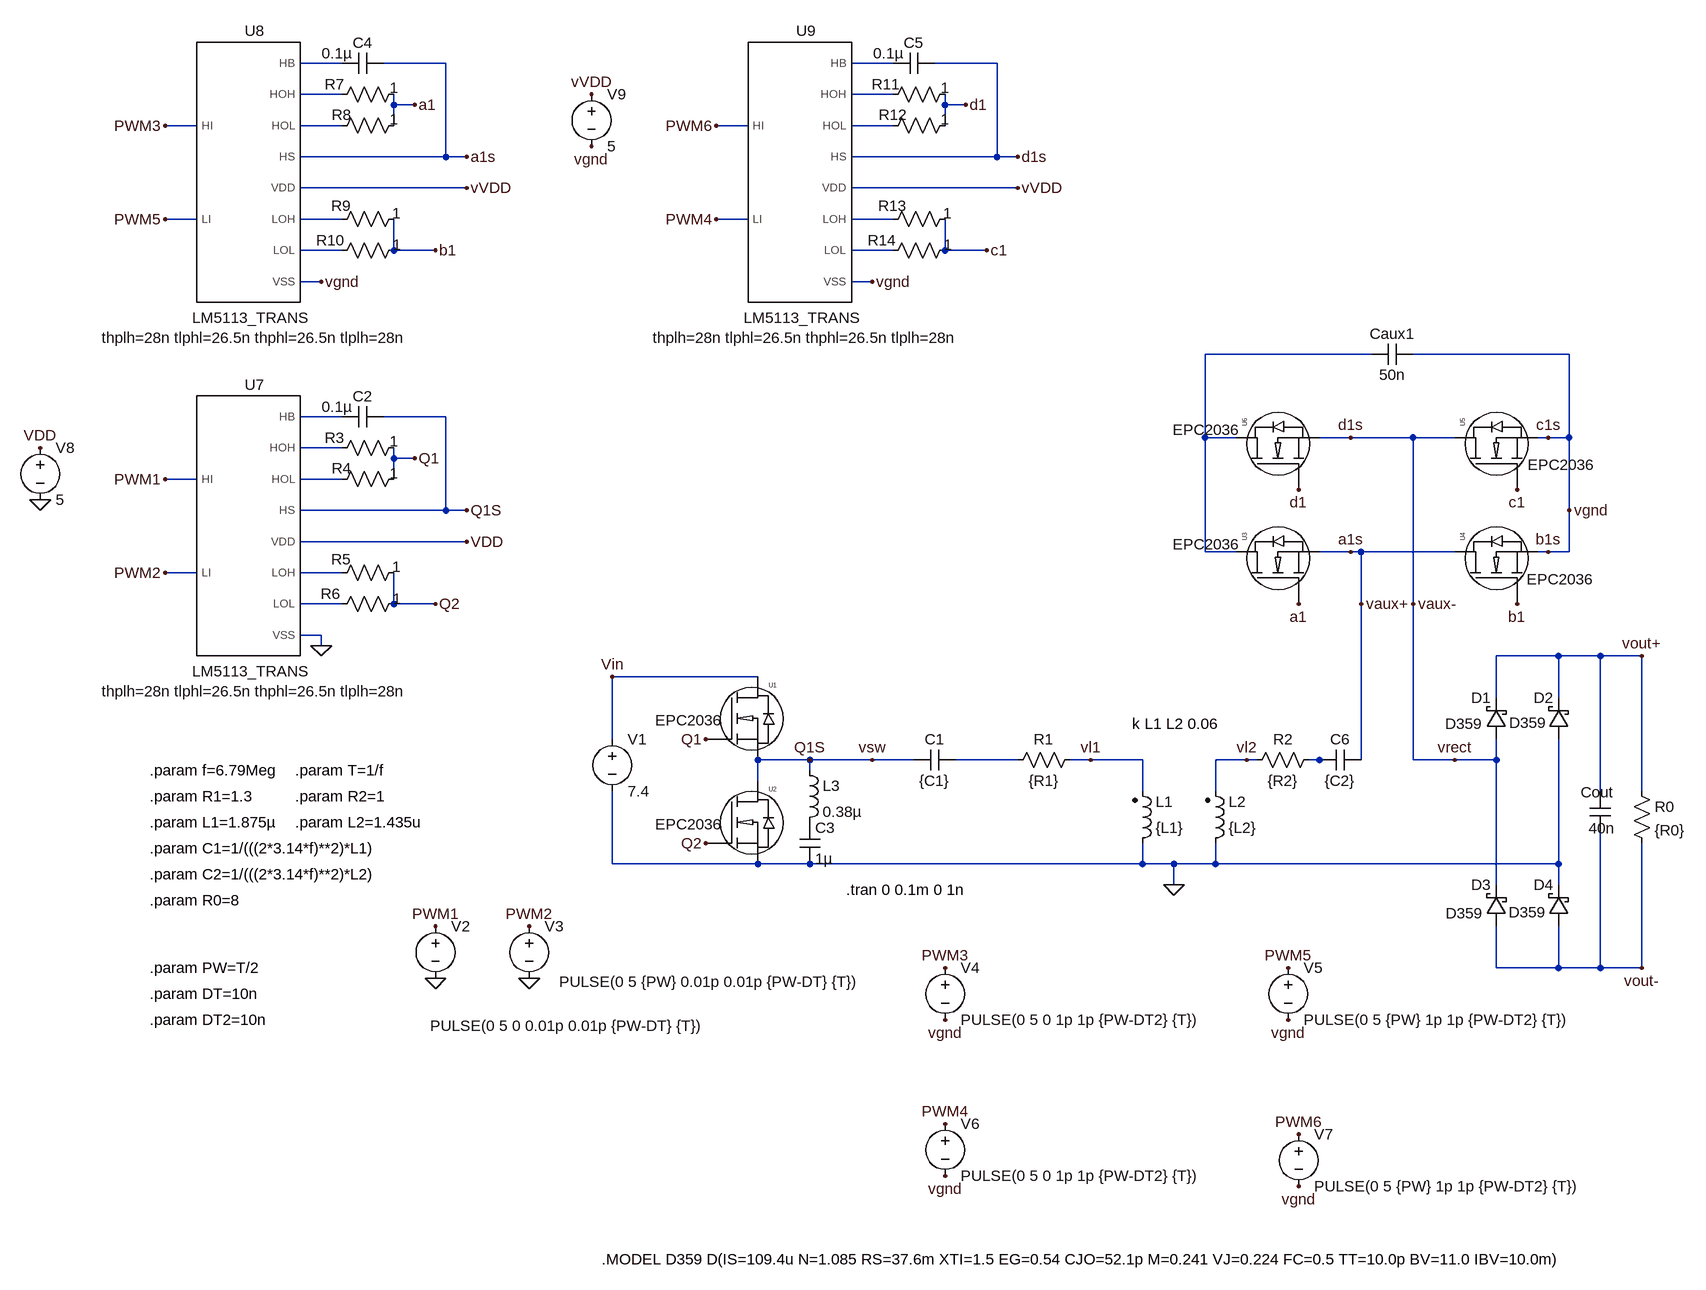
[diagram p0: schematic WPT_inv_rect_aux_driver.asc]
WPT_inv_rect_aux_driver.asc, the LTspice schematic file:
Version 4
SHEET 1 2368 1432
WIRE -1920 -576 -1984 -576
WIRE -1760 -576 -1856 -576
WIRE -1072 -576 -1136 -576
WIRE -912 -576 -1008 -576
WIRE -1920 -528 -1984 -528
WIRE -1072 -528 -1136 -528
WIRE -1840 -512 -1840 -528
WIRE -1808 -512 -1840 -512
WIRE -992 -512 -992 -528
WIRE -960 -512 -992 -512
WIRE -2144 -480 -2192 -480
WIRE -1920 -480 -1984 -480
WIRE -1840 -480 -1840 -512
WIRE -1296 -480 -1344 -480
WIRE -1072 -480 -1136 -480
WIRE -992 -480 -992 -512
WIRE -1760 -432 -1760 -576
WIRE -1760 -432 -1984 -432
WIRE -1728 -432 -1760 -432
WIRE -912 -432 -912 -576
WIRE -912 -432 -1136 -432
WIRE -880 -432 -912 -432
WIRE -1728 -384 -1984 -384
WIRE -880 -384 -1136 -384
WIRE -2144 -336 -2192 -336
WIRE -1920 -336 -1984 -336
WIRE -1296 -336 -1344 -336
WIRE -1072 -336 -1136 -336
WIRE -1920 -288 -1984 -288
WIRE -1840 -288 -1840 -336
WIRE -1776 -288 -1840 -288
WIRE -1072 -288 -1136 -288
WIRE -992 -288 -992 -336
WIRE -928 -288 -992 -288
WIRE -1952 -240 -1984 -240
WIRE -1104 -240 -1136 -240
WIRE -336 -128 -592 -128
WIRE -32 -128 -272 -128
WIRE -1920 -32 -1984 -32
WIRE -1760 -32 -1856 -32
WIRE -592 0 -592 -128
WIRE -544 0 -592 0
WIRE -368 0 -416 0
WIRE -272 0 -368 0
WIRE -208 0 -272 0
WIRE -64 0 -80 0
WIRE -32 0 -32 -128
WIRE -32 0 -64 0
WIRE -1920 16 -1984 16
WIRE -1840 32 -1840 16
WIRE -1808 32 -1840 32
WIRE -2144 64 -2192 64
WIRE -1920 64 -1984 64
WIRE -1840 64 -1840 32
WIRE -1760 112 -1760 -32
WIRE -1760 112 -1984 112
WIRE -1728 112 -1760 112
WIRE -32 112 -32 0
WIRE -1728 160 -1984 160
WIRE -592 176 -592 0
WIRE -544 176 -592 176
WIRE -368 176 -416 176
WIRE -352 176 -368 176
WIRE -208 176 -352 176
WIRE -64 176 -80 176
WIRE -32 176 -32 112
WIRE -32 176 -64 176
WIRE -2144 208 -2192 208
WIRE -1920 208 -1984 208
WIRE -1920 256 -1984 256
WIRE -1840 256 -1840 208
WIRE -1776 256 -1840 256
WIRE -352 256 -352 176
WIRE -272 256 -272 0
WIRE -1952 304 -1984 304
WIRE -1952 320 -1952 304
WIRE -48 336 -144 336
WIRE 16 336 -48 336
WIRE 80 336 16 336
WIRE -1280 368 -1504 368
WIRE -144 400 -144 336
WIRE -48 400 -48 336
WIRE -1504 464 -1504 368
WIRE -1200 496 -1280 496
WIRE -1104 496 -1200 496
WIRE -1040 496 -1104 496
WIRE -880 496 -976 496
WIRE -768 496 -800 496
WIRE -688 496 -768 496
WIRE -528 496 -576 496
WIRE -512 496 -528 496
WIRE -416 496 -432 496
WIRE -400 496 -416 496
WIRE -352 496 -352 256
WIRE -272 496 -272 256
WIRE -208 496 -272 496
WIRE -144 496 -144 464
WIRE -144 496 -208 496
WIRE -1200 512 -1200 496
WIRE -1280 528 -1280 496
WIRE -688 544 -688 496
WIRE -576 544 -576 496
WIRE 16 544 16 336
WIRE 80 544 80 336
WIRE -1504 656 -1504 544
WIRE -1280 656 -1504 656
WIRE -1200 656 -1280 656
WIRE -688 656 -688 624
WIRE -688 656 -1200 656
WIRE -640 656 -688 656
WIRE -576 656 -576 624
WIRE -576 656 -640 656
WIRE -48 656 -48 464
WIRE -48 656 -576 656
WIRE -640 688 -640 656
WIRE -144 688 -144 496
WIRE -48 688 -48 656
WIRE -144 816 -144 752
WIRE -48 816 -48 752
WIRE -48 816 -144 816
WIRE 16 816 16 608
WIRE 16 816 -48 816
WIRE 80 816 80 624
WIRE 80 816 16 816
FLAG -640 688 0
FLAG -768 496 vl1
FLAG -528 496 vl2
FLAG -1360 464 Q1
FLAG -1360 624 Q2
FLAG -1632 832 0
FLAG -1200 496 Q1S
FLAG -1504 368 Vin
FLAG -1776 752 PWM1
FLAG -1632 752 PWM2
FLAG -1104 496 vsw
FLAG 80 336 vout+
FLAG 80 816 vout-
FLAG -208 496 vrect
FLAG -448 256 a1
FLAG -112 80 c1
FLAG -112 256 b1
FLAG -448 80 d1
FLAG -272 256 vaux-
FLAG -368 176 a1s
FLAG -368 0 d1s
FLAG -64 176 b1s
FLAG -64 0 c1s
FLAG -352 256 vaux+
FLAG -992 816 PWM3
FLAG -464 816 PWM5
FLAG -992 1056 PWM4
FLAG -448 1072 PWM6
FLAG -2384 16 VDD
FLAG -1808 32 Q1
FLAG -1776 256 Q2
FLAG -1728 112 Q1S
FLAG -2192 64 PWM1
FLAG -2192 208 PWM2
FLAG -1728 160 VDD
FLAG -1952 320 0
FLAG -2384 96 0
FLAG -1776 832 0
FLAG -1536 -528 vVDD
FLAG -1808 -512 a1
FLAG -1776 -288 b1
FLAG -1728 -432 a1s
FLAG -2192 -480 PWM3
FLAG -2192 -336 PWM5
FLAG -1728 -384 vVDD
FLAG -960 -512 d1
FLAG -928 -288 c1
FLAG -880 -432 d1s
FLAG -1344 -480 PWM6
FLAG -1344 -336 PWM4
FLAG -880 -384 vVDD
FLAG -32 112 vgnd
FLAG -992 896 vgnd
FLAG -464 896 vgnd
FLAG -448 1152 vgnd
FLAG -992 1136 vgnd
FLAG -1536 -448 vgnd
FLAG -1952 -240 vgnd
FLAG -1104 -240 vgnd
SYMBOL cap -976 480 R90
WINDOW 0 0 32 VBottom 2
WINDOW 3 32 32 VTop 2
SYMATTR InstName C1
SYMATTR Value {C1}
SYMBOL ind2 -704 640 M180
WINDOW 0 36 80 Left 2
WINDOW 3 36 40 Left 2
SYMATTR InstName L1
SYMATTR Value {L1}
SYMATTR Type ind
SYMBOL ind2 -592 640 M180
WINDOW 0 36 80 Left 2
WINDOW 3 36 40 Left 2
SYMATTR InstName L2
SYMATTR Value {L2}
SYMATTR Type ind
SYMBOL res -784 480 R90
WINDOW 0 0 56 VBottom 2
WINDOW 3 32 56 VTop 2
SYMATTR InstName R1
SYMATTR Value {R1}
SYMBOL res -416 480 R90
WINDOW 0 0 56 VBottom 2
WINDOW 3 32 56 VTop 2
SYMATTR InstName R2
SYMATTR Value {R2}
SYMBOL voltage -1776 736 R0
WINDOW 123 0 0 Left 0
WINDOW 39 0 0 Left 0
WINDOW 3 -8 169 Left 2
SYMATTR Value PULSE(0 5 0 0.01p 0.01p {PW-DT} {T})
SYMATTR InstName V2
SYMBOL EPCGaN -1360 464 R0
WINDOW 3 -78 -29 Left 2
SYMATTR Value EPC2036
SYMATTR InstName U1
SYMBOL EPCGaN -1360 624 R0
WINDOW 3 -78 -29 Left 2
SYMATTR Value EPC2036
SYMATTR InstName U2
SYMBOL voltage -1504 448 R0
WINDOW 123 0 0 Left 0
WINDOW 39 0 0 Left 0
SYMATTR InstName V1
SYMATTR Value 7.4
SYMBOL voltage -1632 736 R0
WINDOW 123 0 0 Left 0
WINDOW 39 0 0 Left 0
WINDOW 3 46 101 Left 2
SYMATTR Value PULSE(0 5 {PW} 0.01p 0.01p {PW-DT} {T})
SYMATTR InstName V3
SYMBOL cap -1216 592 R0
SYMATTR InstName C3
SYMATTR Value 1µ
SYMBOL ind -1216 496 R0
SYMATTR InstName L3
SYMATTR Value 0.38µ
SYMBOL res 64 528 R0
SYMATTR InstName R0
SYMATTR Value {R0}
SYMBOL cap 0 544 R0
WINDOW 0 -14 2 Left 2
WINDOW 3 -2 57 Left 2
SYMATTR InstName Cout
SYMATTR Value 40n
SYMBOL schottky -128 464 R180
WINDOW 0 24 64 Left 2
WINDOW 3 37 24 Left 2
SYMATTR InstName D1
SYMATTR Value D359
SYMBOL schottky -32 464 R180
WINDOW 0 24 64 Left 2
WINDOW 3 34 25 Left 2
SYMATTR InstName D2
SYMATTR Value D359
SYMBOL schottky -128 752 R180
WINDOW 0 24 64 Left 2
WINDOW 3 36 20 Left 2
SYMATTR InstName D3
SYMATTR Value D359
SYMBOL schottky -32 752 R180
WINDOW 0 24 64 Left 2
WINDOW 3 35 22 Left 2
SYMATTR InstName D4
SYMATTR Value D359
SYMBOL cap -272 -144 R90
WINDOW 0 0 32 VBottom 2
WINDOW 3 32 32 VTop 2
SYMATTR InstName Caux1
SYMATTR Value 50n
SYMBOL EPCGaN -448 256 R270
WINDOW 3 92 -194 VRight 2
SYMATTR Value EPC2036
SYMATTR InstName U3
SYMBOL EPCGaN -112 256 R270
WINDOW 3 38 15 VRight 2
SYMATTR Value EPC2036
SYMATTR InstName U4
SYMBOL EPCGaN -112 80 R270
WINDOW 3 38 16 VRight 2
SYMATTR Value EPC2036
SYMATTR InstName U5
SYMBOL EPCGaN -448 80 R270
WINDOW 3 92 -194 VRight 2
SYMATTR Value EPC2036
SYMATTR InstName U6
SYMBOL voltage -992 800 R0
WINDOW 123 0 0 Left 0
WINDOW 39 24 124 Left 2
SYMATTR InstName V4
SYMATTR Value PULSE(0 5 0 1p 1p {PW-DT2} {T})
SYMBOL voltage -464 800 R0
WINDOW 123 0 0 Left 0
WINDOW 39 24 124 Left 2
SYMATTR InstName V5
SYMATTR Value PULSE(0 5 {PW} 1p 1p {PW-DT2} {T})
SYMBOL voltage -992 1040 R0
WINDOW 123 0 0 Left 0
WINDOW 39 24 124 Left 2
SYMATTR InstName V6
SYMATTR Value PULSE(0 5 0 1p 1p {PW-DT2} {T})
SYMBOL voltage -448 1056 R0
WINDOW 123 0 0 Left 0
WINDOW 39 24 124 Left 2
SYMATTR InstName V7
SYMATTR Value PULSE(0 5 {PW} 1p 1p {PW-DT2} {T})
SYMBOL LM5113_TRANS -2048 240 R0
SYMATTR InstName U7
SYMBOL res -1824 0 R90
WINDOW 0 16 107 VBottom 2
WINDOW 3 -10 16 VTop 2
SYMATTR InstName R3
SYMATTR Value 1
SYMBOL res -1824 48 R90
WINDOW 0 15 96 VBottom 2
WINDOW 3 -9 16 VTop 2
SYMATTR InstName R4
SYMATTR Value 1
SYMBOL res -1824 192 R90
WINDOW 0 11 97 VBottom 2
WINDOW 3 -9 12 VTop 2
SYMATTR InstName R5
SYMATTR Value 1
SYMBOL res -1824 240 R90
WINDOW 0 16 113 VBottom 2
WINDOW 3 -8 11 VTop 2
SYMATTR InstName R6
SYMATTR Value 1
SYMBOL cap -1856 -48 R90
WINDOW 0 0 32 VBottom 2
WINDOW 3 -15 71 VTop 2
SYMATTR InstName C2
SYMATTR Value 0.1µ
SYMBOL voltage -2384 0 R0
WINDOW 123 0 0 Left 0
WINDOW 39 0 0 Left 0
SYMATTR InstName V8
SYMATTR Value 5
SYMBOL LM5113_TRANS -2048 -304 R0
SYMATTR InstName U8
SYMBOL res -1824 -544 R90
WINDOW 0 16 107 VBottom 2
WINDOW 3 -10 16 VTop 2
SYMATTR InstName R7
SYMATTR Value 1
SYMBOL res -1824 -496 R90
WINDOW 0 15 96 VBottom 2
WINDOW 3 -9 16 VTop 2
SYMATTR InstName R8
SYMATTR Value 1
SYMBOL res -1824 -352 R90
WINDOW 0 11 97 VBottom 2
WINDOW 3 -9 12 VTop 2
SYMATTR InstName R9
SYMATTR Value 1
SYMBOL res -1824 -304 R90
WINDOW 0 16 113 VBottom 2
WINDOW 3 -8 11 VTop 2
SYMATTR InstName R10
SYMATTR Value 1
SYMBOL cap -1856 -592 R90
WINDOW 0 0 32 VBottom 2
WINDOW 3 -15 71 VTop 2
SYMATTR InstName C4
SYMATTR Value 0.1µ
SYMBOL voltage -1536 -544 R0
WINDOW 123 0 0 Left 0
WINDOW 39 0 0 Left 0
SYMATTR InstName V9
SYMATTR Value 5
SYMBOL LM5113_TRANS -1200 -304 R0
SYMATTR InstName U9
SYMBOL res -976 -544 R90
WINDOW 0 16 107 VBottom 2
WINDOW 3 -10 16 VTop 2
SYMATTR InstName R11
SYMATTR Value 1
SYMBOL res -976 -496 R90
WINDOW 0 15 96 VBottom 2
WINDOW 3 -9 16 VTop 2
SYMATTR InstName R12
SYMATTR Value 1
SYMBOL res -976 -352 R90
WINDOW 0 11 97 VBottom 2
WINDOW 3 -9 12 VTop 2
SYMATTR InstName R13
SYMATTR Value 1
SYMBOL res -976 -304 R90
WINDOW 0 16 113 VBottom 2
WINDOW 3 -8 11 VTop 2
SYMATTR InstName R14
SYMATTR Value 1
SYMBOL cap -1008 -592 R90
WINDOW 0 0 32 VBottom 2
WINDOW 3 -15 71 VTop 2
SYMATTR InstName C5
SYMATTR Value 0.1µ
SYMBOL cap -352 480 R90
WINDOW 0 0 32 VBottom 2
WINDOW 3 32 32 VTop 2
SYMATTR InstName C6
SYMATTR Value {C2}
TEXT -704 440 Left 2 !k L1 L2 0.06
TEXT -1144 696 Left 2 !.tran 0 0.1m 0 1n
TEXT -2216 816 Left 2 !.param PW=T/2
TEXT -2216 856 Left 2 !.param DT=10n
TEXT -2216 592 Left 2 !.param L1=1.875µ
TEXT -2216 552 Left 2 !.param R1=1.3
TEXT -2216 632 Left 2 !.param C1=1/(((2*3.14*f)**2)*L1)
TEXT -2216 512 Left 2 !.param f=6.79Meg
TEXT -1992 512 Left 2 !.param T=1/f
TEXT -1992 552 Left 2 !.param R2=1
TEXT -1992 592 Left 2 !.param L2=1.435u
TEXT -2216 672 Left 2 !.param C2=1/(((2*3.14*f)**2)*L2)
TEXT -2216 712 Left 2 !.param R0=8
TEXT -1520 1264 Left 2 !.MODEL D359 D(IS=109.4u N=1.085 RS=37.6m XTI=1.5 EG=0.54 CJO=52.1p M=0.241 VJ=0.224 FC=0.5 TT=10.0p BV=11.0 IBV=10.0m)
TEXT -2216 896 Left 2 !.param DT2=10n

The netlist it stands for:
* WPT_inv_rect_aux_driver.asc
C1 N017 vsw {C1}
L1 0 vl1 {L1}
L2 0 vl2 {L2}
R1 vl1 N017 {R1}
R2 N018 vl2 {R2}
V2 PWM1 0 PULSE(0 5 0 0.01p 0.01p {PW-DT} {T})
XU1 Q1 Vin vsw EPC2036  ; pins gatein drainin N_0
XU2 Q2 vsw 0 EPC2036  ; pins gatein drainin N_0
V1 Vin 0 7.4
V3 PWM2 0 PULSE(0 5 {PW} 0.01p 0.01p {PW-DT} {T})
C3 P001 0 1µ
L3 vsw P001 0.38µ
R0 vout+ vout- {R0}
Cout vout+ vout- 40n
D1 d1s vout+ D359
D2 0 vout+ D359
D3 vout- d1s D359
D4 vout- 0 D359
Caux1 vgnd N011 50n
XU3 a1 N011 vaux+ EPC2036  ; pins gatein drainin N_0
XU4 b1 vaux+ vgnd EPC2036  ; pins gatein drainin N_0
XU5 c1 d1s vgnd EPC2036  ; pins gatein drainin N_0
XU6 d1 N011 d1s EPC2036  ; pins gatein drainin N_0
V4 PWM3 vgnd PULSE(0 5 0 1p 1p {PW-DT2} {T})
V5 PWM5 vgnd PULSE(0 5 {PW} 1p 1p {PW-DT2} {T})
V6 PWM4 vgnd PULSE(0 5 0 1p 1p {PW-DT2} {T})
V7 PWM6 vgnd PULSE(0 5 {PW} 1p 1p {PW-DT2} {T})
XU7 N013 N014 N012 PWM1 vsw PWM2 N015 N016 VDD 0 LM5113_TRANS thplh=28n tlphl=26.5n thphl=26.5n tlplh=28n  ; pins HOH HOL HB HI HS LI LOH LOL VDD VSS
R3 Q1 N013 1
R4 Q1 N014 1
R5 Q2 N015 1
R6 Q2 N016 1
C2 vsw N012 0.1µ
V8 VDD 0 5
XU8 N003 N005 N001 PWM3 vaux+ PWM5 N007 N009 vVDD vgnd LM5113_TRANS thplh=28n tlphl=26.5n thphl=26.5n tlplh=28n  ; pins HOH HOL HB HI HS LI LOH LOL VDD VSS
R7 a1 N003 1
R8 a1 N005 1
R9 b1 N007 1
R10 b1 N009 1
C4 vaux+ N001 0.1µ
V9 vVDD vgnd 5
XU9 N004 N006 N002 PWM6 d1s PWM4 N008 N010 vVDD vgnd LM5113_TRANS thplh=28n tlphl=26.5n thphl=26.5n tlplh=28n  ; pins HOH HOL HB HI HS LI LOH LOL VDD VSS
R11 d1 N004 1
R12 d1 N006 1
R13 c1 N008 1
R14 c1 N010 1
C5 d1s N002 0.1µ
C6 vaux+ N018 {C2}
.model D D
.lib standard.dio
k L1 L2 0.06
.tran 0 0.1m 0 1n
.param PW=T/2
.param DT=10n
.param L1=1.875µ
.param R1=1.3
.param C1=1/(((2*3.14*f)**2)*L1)
.param f=6.79Meg
.param T=1/f
.param R2=1
.param L2=1.435u
.param C2=1/(((2*3.14*f)**2)*L2)
.param R0=8
.MODEL D359 D(IS=109.4u N=1.085 RS=37.6m XTI=1.5 EG=0.54 CJO=52.1p M=0.241 VJ=0.224 FC=0.5 TT=10.0p BV=11.0 IBV=10.0m)
.param DT2=10n
.lib EPCGanlibrary.lib
.lib LM5113_TRANS.lib
.backanno
.end